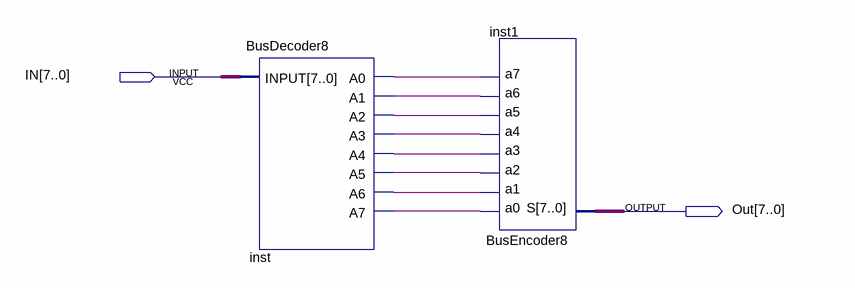
[diagram p0: schematic sheet]
// Quartus schematic Inverse8Bit.bdf as structural Verilog: 2 symbols, 2 pins
module Inverse8Bit (
  input  [7:0] IN,
  output [7:0] Out
);

  wire inst_a0, inst_a1, inst_a2, inst_a3, inst_a4, inst_a5, inst_a6, inst_a7;

  BusDecoder8 inst (
    .INPUT(IN), .A0(inst_a0), .A1(inst_a1), .A2(inst_a2), .A3(inst_a3), .A4(inst_a4), .A5(inst_a5),
    .A6(inst_a6), .A7(inst_a7));
  BusEncoder8 inst1 (
    .a0(inst_a7), .a1(inst_a6), .a2(inst_a5), .a3(inst_a4), .a4(inst_a3), .a5(inst_a2), .a6(inst_a1),
    .a7(inst_a0), .S(Out));
endmodule
